# EAGLE design GBM16-CPU (EAGLE 5.10)
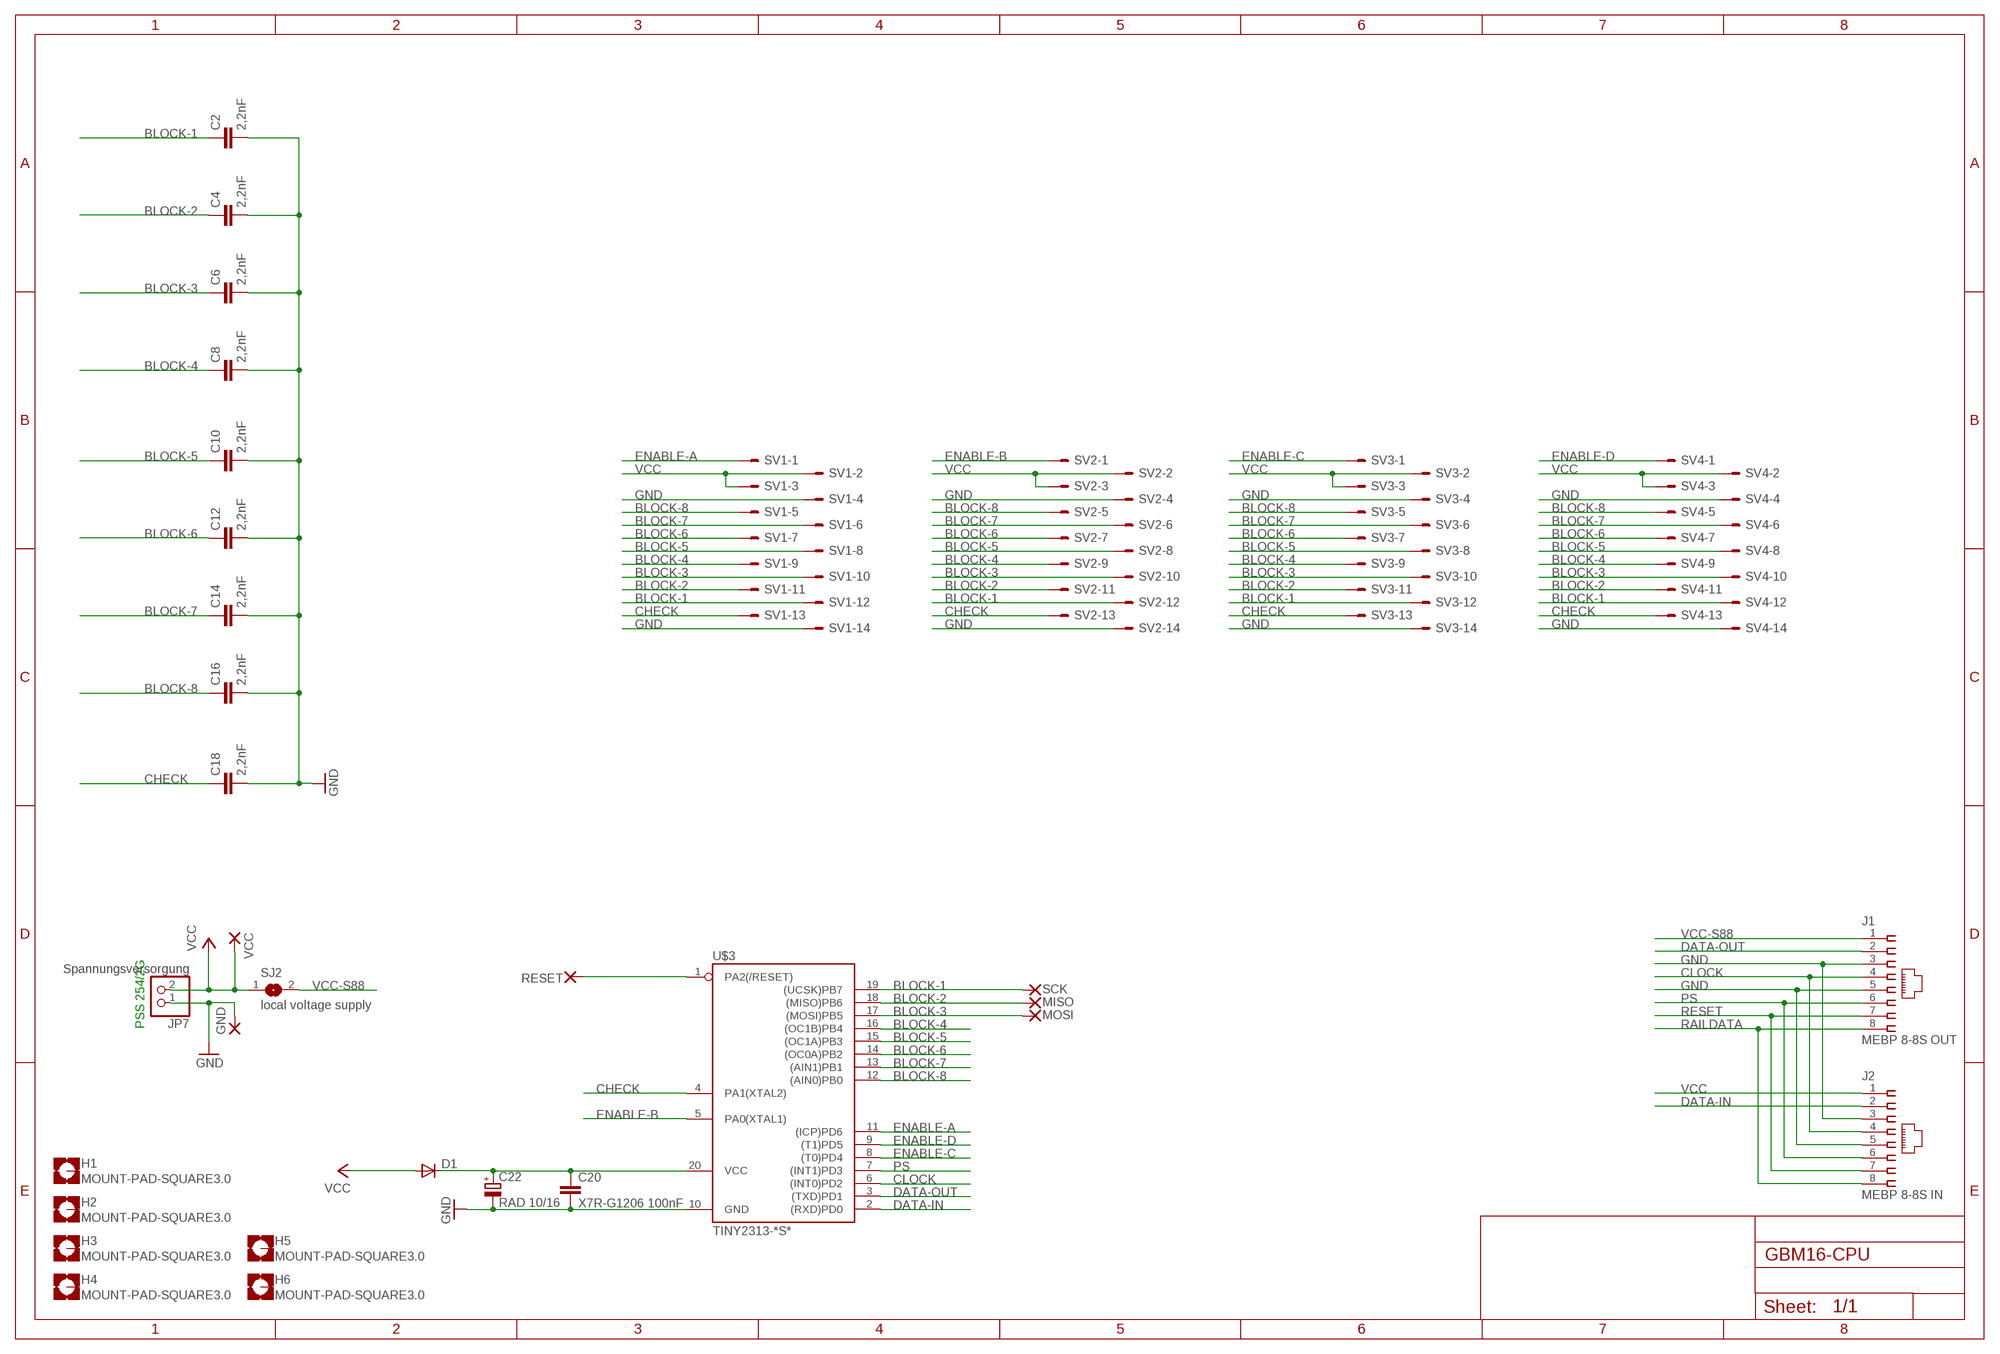
[diagram p0: schematic, sheet 1]

## Parts
C2  2,2nF  C-EUC1206  [C1206]
C4  2,2nF  C-EUC1206  [C1206]
C6  2,2nF  C-EUC1206  [C1206]
C8  2,2nF  C-EUC1206  [C1206]
C10  2,2nF  C-EUC1206  [C1206]
C12  2,2nF  C-EUC1206  [C1206]
C14  2,2nF  C-EUC1206  [C1206]
C16  2,2nF  C-EUC1206  [C1206]
C18  2,2nF  C-EUC1206  [C1206]
C20  X7R-G1206 100nF  C-EUC1206  [C1206]
C22  RAD 10/16  CPOL-EUE2.5-6  [E2,5-6]
D1  DIODE-MINIMELF  [MINIMELF]
GND  SMD2  [SMD1,27-2,54]
H1  MOUNT-PAD-SQUARE3.0  [3,0-PAD-SQUARE]
H2  MOUNT-PAD-SQUARE3.0  [3,0-PAD-SQUARE]
H3  MOUNT-PAD-SQUARE3.0  [3,0-PAD-SQUARE]
H4  MOUNT-PAD-SQUARE3.0  [3,0-PAD-SQUARE]
H5  MOUNT-PAD-SQUARE3.0  [3,0-PAD-SQUARE]
H6  MOUNT-PAD-SQUARE3.0  [3,0-PAD-SQUARE]
J1  MEBP 8-8S OUT  555162-1  [555162-1]
J2  MEBP 8-8S IN  555162-1  [555162-1]
JP7  Spannungsversorgung  PINHD-1X2  [1X02]
MISO  SMD2  [SMD1,27-2,54]
MOSI  SMD2  [SMD1,27-2,54]
RESET  SMD2  [SMD1,27-2,54]
SCK  SMD2  [SMD1,27-2,54]
SJ2  local voltage supply  SJ  [SJ]
SV1  ML14E  [ML14]
SV2  ML14E  [ML14]
SV3  ML14E  [ML14]
SV4  ML14E  [ML14]
U$3  TINY2313-*S*  [SO20L$]
VCC  SMD2  [SMD1,27-2,54]

## Nets
BLOCK-1: C2.1 SCK.1(P) SV1.12 SV2.12 SV3.12 SV4.12 U$3.19((UCSK)PB7)
BLOCK-2: C4.1 MISO.1(P) SV1.11 SV2.11 SV3.11 SV4.11 U$3.18((MISO)PB6)
BLOCK-3: C6.1 MOSI.1(P) SV1.10 SV2.10 SV3.10 SV4.10 U$3.17((MOSI)PB5)
BLOCK-4: C8.1 SV1.9 SV2.9 SV3.9 SV4.9 U$3.16((OC1B)PB4)
BLOCK-5: C10.1 SV1.8 SV2.8 SV3.8 SV4.8 U$3.15((OC1A)PB3)
BLOCK-6: C12.1 SV1.7 SV2.7 SV3.7 SV4.7 U$3.14((OC0A)PB2)
BLOCK-7: C14.1 SV1.6 SV2.6 SV3.6 SV4.6 U$3.13((AIN1)PB1)
BLOCK-8: C16.1 SV1.5 SV2.5 SV3.5 SV4.5 U$3.12((AIN0)PB0)
CHECK: C18.1 SV1.13 SV2.13 SV3.13 SV4.13 U$3.4(PA1(XTAL2))
CLOCK: J1.4 J2.4 U$3.6((INT0)PD2)
DATA-IN: J2.2 U$3.2((RXD)PD0)
DATA-OUT: J1.2 U$3.3((TXD)PD1)
ENABLE-A: SV1.1 U$3.11((ICP)PD6)
ENABLE-B: SV2.1 U$3.5(PA0(XTAL1))
ENABLE-C: SV3.1 U$3.8((T0)PD4)
ENABLE-D: SV4.1 U$3.9((T1)PD5)
GND: C2.2 C4.2 C6.2 C8.2 C10.2 C12.2 C14.2 C16.2 C18.2 C20.2 C22.- GND.1(P) J1.3 J1.5 J2.3 J2.5 JP7.1 SV1.4 SV1.14 SV2.4 SV2.14 SV3.4 SV3.14 SV4.4 SV4.14 U$3.10(GND)
N$1: RESET.1(P) U$3.1(PA2(/RESET))
N$8: C20.1 C22.+ D1.C U$3.20(VCC)
PS: J1.6 J2.6 U$3.7((INT1)PD3)
RAILDATA: J1.8 J2.8
RESET: J1.7 J2.7
VCC: D1.A J2.1 JP7.2 SJ2.1 SV1.2 SV1.3 SV2.2 SV2.3 SV3.2 SV3.3 SV4.2 SV4.3 VCC.1(P)
VCC-S88: J1.1 SJ2.2
Unconnected: H1.B3,0(MOUNT) H2.B3,0(MOUNT) H3.B3,0(MOUNT) H4.B3,0(MOUNT) H5.B3,0(MOUNT) H6.B3,0(MOUNT)

## Notes on the sheet
- PSS 254/2G

## Library data of the parts
C2 C4 C6 C8 C10 C12 C14 C16 C18 C20 = rcl:C-EU: CAPACITOR, European symbol
C22 = rcl:CPOL-EU: POLARIZED CAPACITOR, European symbol
D1 = diode:DIODE-: DIODE
GND MISO MOSI RESET SCK VCC = wirepad:SMD2: SMD PAD
H1-H6 = holes:MOUNT-PAD-SQUARE: MOUNTING PAD, square
J1 J2 = con-amp:555162-1: AMP connector
JP7 = pinhead:PINHD-1X2: PIN HEADER
SJ2 = jumper:SJ: SMD solder JUMPER
SV1-SV4 = con-ml:ML14E: HARTING
U$3 = avr-6:TINY2313*: Atmel Tiny2313 2K Flash, 128 bytes EEPROM, 128 bytes RAM

## Board
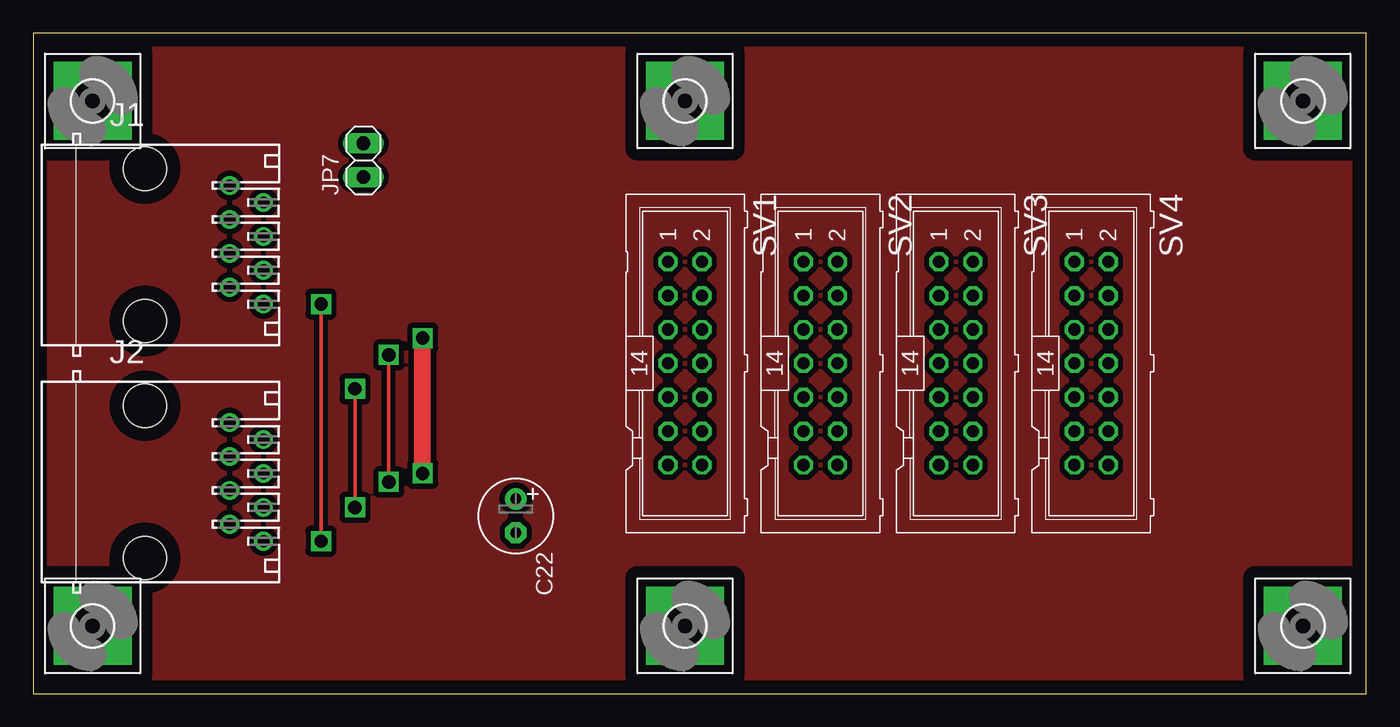
[diagram p1: board, top side]
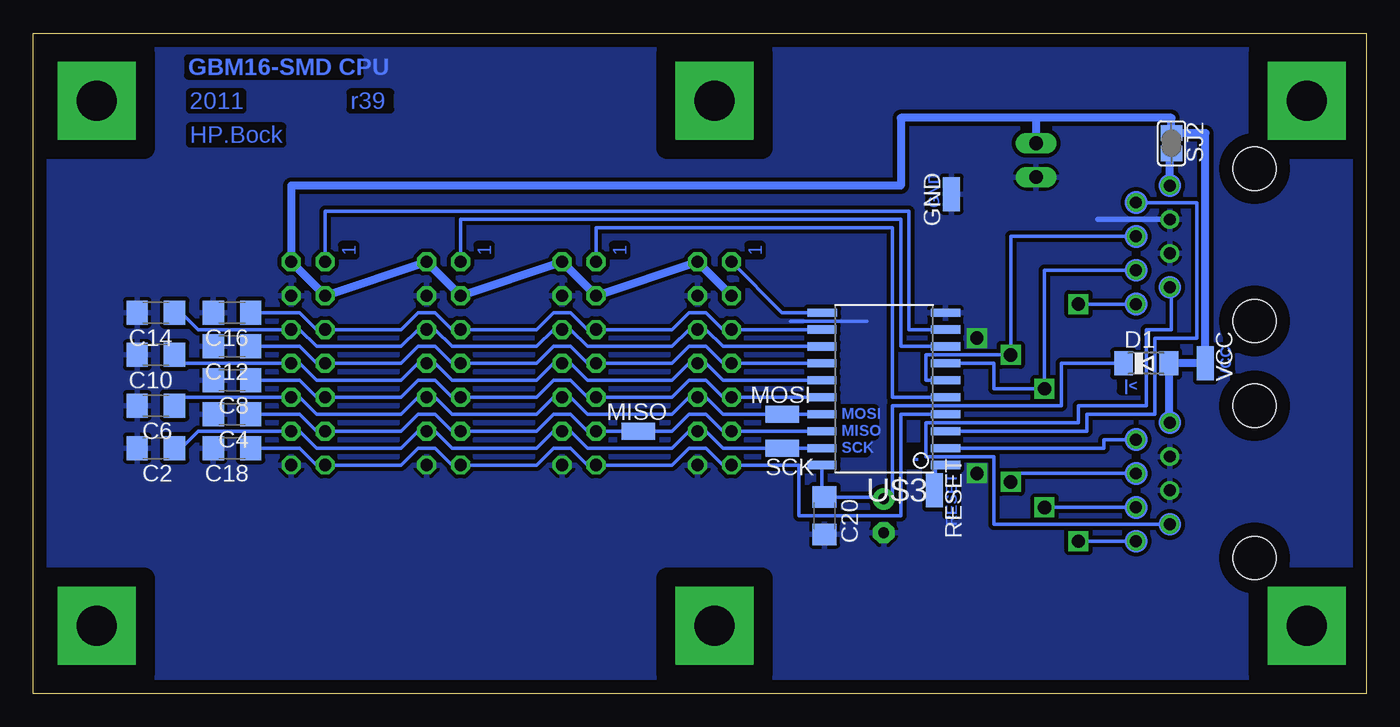
[diagram p2: board, bottom side, seen from below]

Size 100 x 49.52 mm. Coordinates in mm from the lower left corner, seen from the top.
Outline: 0,0 100,0 100,49.52 0,49.52 0,0
Copper layers (1*16): Top 0.035mm / dielectric 1.5mm / Bottom 0.035mm
Design rules "default": minimum track width 10mil, minimum drill 24mil, track to track 8mil, track to pad 8mil, pad to pad 8mil, via to via 8mil, smd to smd 8mil, copper to edge 40mil, drill to drill 8mil, minimum pad ring 10mil, minimum via ring 8mil, stop-mask expansion 4mil, vias tented up to drill 0mil, thermal gap 10mil

### Footprints (pad centres in the part's own frame; a part is rotated, then mirrored left to right if it is on the bottom)
C1206 = smd 1.6 x 1.8: 1 -1.4,0; 2 1.4,0
E2,5-6 = drill 0.813 pad 1.6 round: + -1.27,0 | drill 0.813 pad 1.6 octagon: - 1.27,0
MINIMELF = smd 1.4 x 1.8: A 1.7,0; C -1.7,0
SMD1,27-2,54 = smd 1.27 x 2.54: 1 0,0
3,0-PAD-SQUARE = drill 3 pad 5.842 square: B3,0 0,0
555162-1 = drill 0.889 round: 1 -4.445,5.207; 2 -3.175,7.747; 3 -1.905,5.207; 4 -0.635,7.747; 5 0.635,5.207; 6 1.905,7.747; 7 3.175,5.207; 8 4.445,7.747 | hole 3.251: -5.715,-1.143; 5.715,-1.143
1X02 = drill 1.016 long: 1 -1.27,0; 2 1.27,0
SJ = smd 1.168 x 1.6: 1 -0.762,0; 2 0.762,0
ML14 = drill 0.914 octagon: 1 -7.62,-1.27; 2 -7.62,1.27; 3 -5.08,-1.27; 4 -5.08,1.27; 5 -2.54,-1.27; 6 -2.54,1.27; 7 0,-1.27; 8 0,1.27; 9 2.54,-1.27; 10 2.54,1.27; 11 5.08,-1.27; 12 5.08,1.27; 13 7.62,-1.27; 14 7.62,1.27
SO20L$ = smd 0.61 x 2.21: 1 -5.715,-4.636; 2 -4.445,-4.636; 3 -3.175,-4.636; 4 -1.905,-4.636; 5 -0.635,-4.636; 6 0.635,-4.636; 7 1.905,-4.636; 8 3.175,-4.636; 9 4.445,-4.636; 10 5.715,-4.636; 11 5.715,4.61; 12 4.445,4.636; 13 3.175,4.636; 14 1.905,4.636; 15 0.635,4.636; 16 -0.635,4.636; 17 -1.905,4.636; 18 -3.175,4.636; 19 -4.445,4.636; 20 -5.715,4.636

### Placement (x,y rotation side)
C2  90.81,18.41 180 bottom
C4  85.09,20.95 180 bottom
C6  90.81,21.59 180 bottom
C8  85.09,23.5 180 bottom
C10  90.81,25.4 180 bottom
C12  85.09,26.04 180 bottom
C14  90.81,28.57 180 bottom
C16  85.09,28.57 180 bottom
C18  85.09,18.41 180 bottom
C20  40.64,13.34 270 bottom
C22  36.2,13.34 270 top
D1  16.51,24.77 0 bottom
GND  31.11,37.47 0 bottom
H1  4.45,44.45 0 top
H2  95.25,44.45 0 top
H3  4.45,5.08 0 top
H4  95.25,5.08 0 top
H5  48.9,44.45 0 top
H6  48.9,5.08 0 top
J1  9.53,33.66 270 top
J2  9.53,15.88 270 top
JP7  24.77,40.01 90 top
MISO  54.61,19.68 270 bottom
MOSI  43.81,20.95 270 bottom
RESET  32.38,15.24 180 bottom
SCK  43.81,18.41 90 bottom
SJ2  14.61,41.27 270 bottom
SV1  48.9,24.77 270 top
SV2  59.05,24.77 270 top
SV3  69.22,24.77 270 top
SV4  79.38,24.77 270 top
U$3  36.2,22.86 90 bottom
VCC  12.06,24.77 180 bottom

### Tracks (layer width: path | path; a pad name or v marks a point on that pad's centre or on a via)
BLOCK-1
  Bottom 0.254: U$3.19 SCK.1 48.26,18.41 49.53,19.68 SV1.12 50.8,19.68 52.07,18.41 58.42,18.41 59.69,19.68 SV2.12 60.96,19.68 62.23,18.41 68.58,18.41 69.85,19.68 SV3.12 71.12,19.68 72.39,18.41 78.74,18.41 80.01,19.68 SV4.12 87.63,19.68 88.9,18.41 C2.1
BLOCK-2
  Bottom 0.254: U$3.18 SV1.11 48.26,19.68 49.53,20.95 50.8,20.95 52.07,19.68 MISO.1 SV2.11 58.42,19.68 59.69,20.95 60.96,20.95 62.23,19.68 SV3.11 68.58,19.68 69.85,20.95 71.12,20.95 72.39,19.68 SV4.11 78.74,19.68 80.01,20.95 C4.1
BLOCK-3
  Bottom 0.254: C6.1 88.77,22.23 SV4.10 80.01,22.23 78.74,20.95 72.39,20.95 71.12,22.23 SV3.10 69.85,22.23 68.58,20.95 62.23,20.95 60.96,22.23 SV2.10 59.69,22.23 58.42,20.95 52.07,20.95 50.8,22.23 SV1.10 49.53,22.23 48.26,20.95 MOSI.1 U$3.17
BLOCK-4
  Bottom 0.254: U$3.16 SV1.9 48.26,22.23 49.53,23.5 50.8,23.5 52.07,22.23 SV2.9 58.42,22.23 59.69,23.5 60.96,23.5 62.23,22.23 SV3.9 68.58,22.23 69.85,23.5 71.12,23.5 72.39,22.23 SV4.9 78.74,22.23 80.01,23.5 C8.1
BLOCK-5
  Bottom 0.254: U$3.15 48.26,23.5 49.53,24.77 SV1.8 50.8,24.77 52.07,23.5 58.42,23.5 59.69,24.77 SV2.8 60.96,24.77 62.23,23.5 68.58,23.5 69.85,24.77 SV3.8 71.12,24.77 72.39,23.5 78.74,23.5 80.01,24.77 SV4.8 88.77,24.77 C10.1
BLOCK-6
  Bottom 0.254: U$3.14 SV1.7 48.26,24.77 49.53,26.04 50.8,26.04 52.07,24.77 SV2.7 58.42,24.77 59.69,26.04 60.96,26.04 62.23,24.77 SV3.7 68.58,24.77 69.85,26.04 71.12,26.04 72.39,24.77 SV4.7 78.74,24.77 80.01,26.04 C12.1
BLOCK-7
  Bottom 0.254: U$3.13 48.26,26.04 49.53,27.3 SV1.6 50.8,27.3 52.07,26.04 58.42,26.04 59.69,27.3 SV2.6 60.96,27.3 62.23,26.04 68.58,26.04 69.85,27.3 SV3.6 71.12,27.3 72.39,26.04 78.74,26.04 80.01,27.3 SV4.6 87.63,27.3 88.9,28.57 C14.1
BLOCK-8
  Bottom 0.254: U$3.12 SV1.5 48.26,27.3 49.53,28.57 50.8,28.57 52.07,27.3 SV2.5 58.42,27.3 59.69,28.57 60.96,28.57 62.23,27.3 SV3.5 68.58,27.3 69.85,28.57 71.12,28.57 72.39,27.3 SV4.5 78.74,27.3 80.01,28.57 C16.1
CHECK
  Bottom 0.254: C18.1 80.01,18.41 78.74,17.14 SV4.13 72.39,17.14 71.12,18.41 69.85,18.41 68.58,17.14 SV3.13 62.23,17.14 60.96,18.41 59.69,18.41 58.42,17.14 SV2.13 52.07,17.14 50.8,18.41 49.53,18.41 48.26,17.14 SV1.13 42.55,17.14 42.55,13.34 34.92,13.34 34.92,20.95 U$3.4
CLOCK  (via drill 1)
  Top 0.254: v26.67,15.88 v26.67,25.4
  Bottom 0.254: J1.4 26.67,34.29 v26.67,25.4 33.02,25.4 33.02,23.5 U$3.6 | v26.67,15.88 26.04,16.51 J2.4
DATA-IN
  Bottom 0.254: U$3.2 19.68,18.41 19.68,19.05 J2.2
DATA-OUT
  Bottom 0.254: U$3.3 20.95,19.68 20.95,20.95 15.88,20.95 15.88,26.67 12.7,26.67 12.7,36.83 J1.2
ENABLE-A
  Bottom 0.254: U$3.11 43.81,28.57 SV1.1
ENABLE-B
  Bottom 0.254: SV2.1 57.78,34.92 35.56,34.92 35.56,22.23 U$3.5
ENABLE-C
  Bottom 0.254: SV3.1 67.94,35.56 34.92,35.56 34.92,26.04 U$3.8
ENABLE-D
  Bottom 0.254: U$3.9 34.29,27.3 34.29,36.2 78.11,36.2 SV4.1
GND  (via drill 1)
  Top 1.27: v29.21,16.51 v29.21,26.67
  Bottom 0.254: 37.47,27.94 43.18,27.94
  Bottom 0.406: J1.3 20.13,35.56
  pour Bottom (isolate 0.305, rank 2): 0,0 100.33,0 99.69,49.53 0,49.53
N$1
  Bottom 0.406: U$3.1 32.38,17.14 RESET.1
N$6
  pour Top (isolate 0.406): 0,0 0,49.53 99.69,49.53 99.69,0
N$8
  Bottom 0.254: U$3.20 40.83,15.37 C20.1 36.2,14.73 35.56,14.73 35.56,21.59 22.86,21.59 22.86,24.77 D1.C
  Bottom 0.406: 36.2,14.73 C22.+
PS  (via drill 1)
  Top 0.254: v24.13,13.97 v24.13,22.86
  Bottom 0.254: U$3.7 27.94,24.77 27.94,22.86 v24.13,22.86 24.13,31.75 J1.6 | J2.6 v24.13,13.97
RAILDATA  (via drill 1)
  Top 0.254: v21.59,11.43 v21.59,29.21
  Bottom 0.254: J2.8 v21.59,11.43 | v21.59,29.21 J1.8
RESET
  Bottom 0.254: J1.7 14.61,30.48 14.61,27.3 16.51,27.3 16.51,21.59 21.59,21.59 21.59,20.32 33.02,20.32 33.02,17.78 27.94,17.78 27.94,12.7 J2.7
VCC
  Bottom 0.254: 14.81,20.32 J2.1
  Bottom 0.61: SV1.3 SV1.2 SV2.3 SV2.2 SV3.3 SV3.2 SV4.3 SV4.2 80.64,38.1 34.92,38.1 34.92,43.18 24.77,43.18 | 14.81,20.32 D1.A VCC.1 12.06,42.04 SJ2.1 14.61,43.18 24.77,43.18 | 24.77,43.18 JP7.2
VCC-S88
  Bottom 0.254: 14.73,40.51 SJ2.2
  Bottom 0.61: J1.1 14.73,40.51
(copper drawn outside any net)
  shapes: Bottom circle x12

### Text on the board
Bottom: GBM16-SMD CPU | r39 | 2011 | HP.Bock | GND | 1 | 1 | 1 | 1 | VCC | |< | MOSI | MISO | SCK | RESET | ·